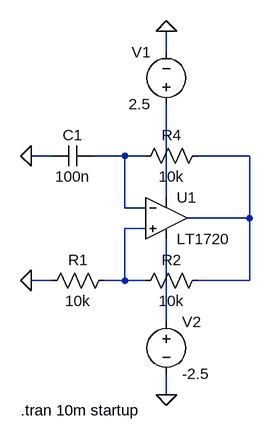
[diagram p0: schematic rc-comp-oscillator.asc]
rc-comp-oscillator.asc, the LTspice schematic file:
Version 4
SHEET 1 880 680
WIRE 208 -80 208 -112
WIRE 32 80 0 80
WIRE 144 80 96 80
WIRE 176 80 144 80
WIRE 336 80 256 80
WIRE 208 144 208 0
WIRE 144 160 144 80
WIRE 176 160 144 160
WIRE 336 176 336 80
WIRE 336 176 240 176
WIRE 176 192 144 192
WIRE 32 272 0 272
WIRE 144 272 144 192
WIRE 144 272 112 272
WIRE 176 272 144 272
WIRE 336 272 336 176
WIRE 336 272 256 272
WIRE 208 336 208 208
WIRE 208 448 208 416
FLAG 208 448 0
FLAG 208 -112 0
FLAG 0 272 0
FLAG 0 80 0
SYMBOL voltage 208 16 R180
WINDOW 0 24 96 Left 2
WINDOW 3 24 16 Left 2
WINDOW 123 0 0 Left 0
WINDOW 39 0 0 Left 0
SYMATTR InstName V1
SYMATTR Value 2.5
SYMBOL voltage 208 320 R0
WINDOW 123 0 0 Left 0
WINDOW 39 0 0 Left 0
SYMATTR InstName V2
SYMATTR Value -2.5
SYMBOL res 128 256 R90
WINDOW 0 0 56 VBottom 2
WINDOW 3 32 56 VTop 2
SYMATTR InstName R1
SYMATTR Value 10k
SYMBOL res 272 256 R90
WINDOW 0 0 56 VBottom 2
WINDOW 3 32 56 VTop 2
SYMATTR InstName R2
SYMATTR Value 10k
SYMBOL res 272 64 R90
WINDOW 0 0 56 VBottom 2
WINDOW 3 32 56 VTop 2
SYMATTR InstName R4
SYMATTR Value 10k
SYMBOL cap 96 64 R90
WINDOW 0 0 32 VBottom 2
WINDOW 3 32 32 VTop 2
SYMATTR InstName C1
SYMATTR Value 100n
SYMBOL Comparators\\LT1720 208 112 R0
SYMATTR InstName U1
TEXT -16 472 Left 2 !.tran 10m startup

The netlist it stands for:
* rc-comp-oscillator.asc
V1 N003 0 2.5
V2 N005 0 -2.5
R1 N004 0 10k
R2 N002 N004 10k
R4 N002 N001 10k
C1 N001 0 100n
XU1 N004 N001 N003 N005 N002 LT1720  ; pins In+ In- V+ V- OUT
.tran 10m startup
.lib LT1720.sub
.backanno
.end